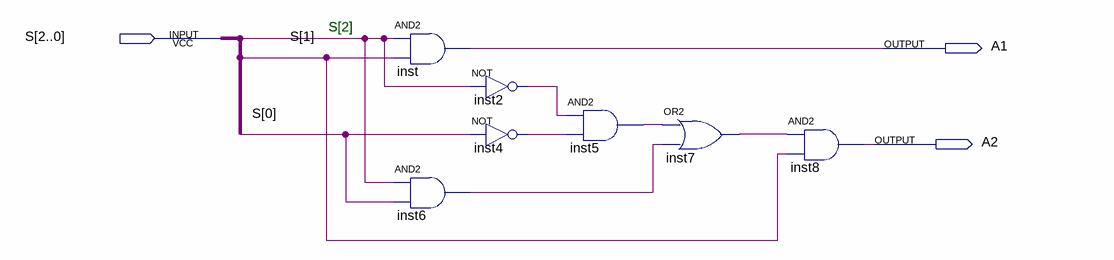
[diagram p0: schematic sheet]
// Quartus schematic vector_operation_selector.bdf as structural Verilog: 7 symbols, 3 pins
module vector_operation_selector (
  input  [2:0] S,
  output A1,
  output A2
);

  wire inst2_out, inst4_out, inst5_out, inst6_out, inst7_out;

  and inst (A1, S[2], S[1]);
  and inst6 (inst6_out, S[2], S[0]);
  not inst2 (inst2_out, S[2]);
  not inst4 (inst4_out, S[0]);
  and inst5 (inst5_out, inst2_out, inst4_out);
  or inst7 (inst7_out, inst5_out, inst6_out);
  and inst8 (A2, inst7_out, S[1]);

  // Notes on the sheet:
  //   S[2]
endmodule
